# EAGLE design nRF51822 (EAGLE 6.4)
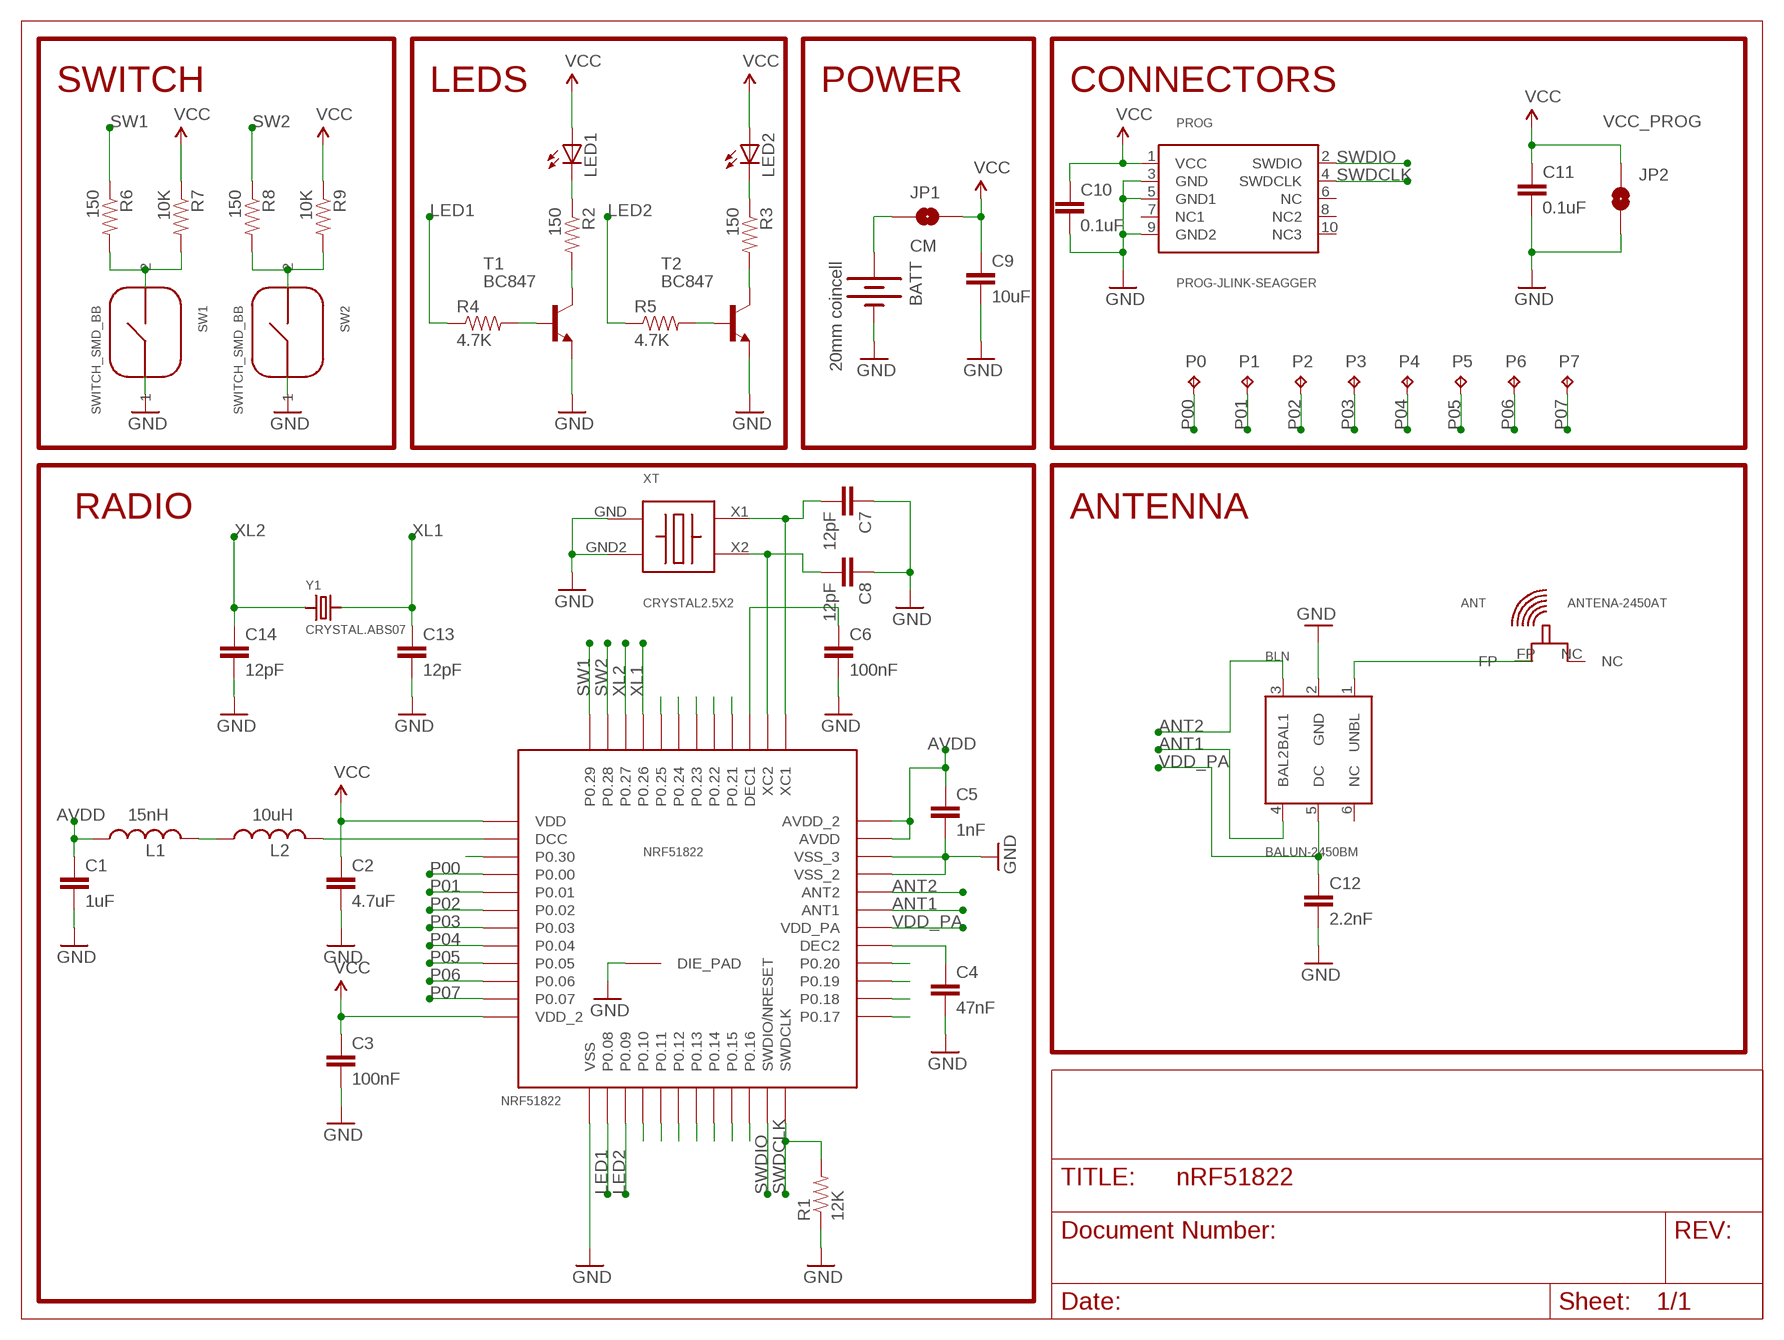
[diagram p0: schematic, sheet 1]

## Parts
ANT  ANTENA-2450AT  [2450AT18B100]
BATT  20mm coincell  BATTERY20MM_4LEGS_OVERPASTE  [BATTCON_20MM_4LEGS_OVERPASTE]
BLN  BALUN-2450BM  [2450BM14A0002]
C1  1uF  CAP0603-CAP  [0603-CAP]
C2  4.7uF  CAP0603-CAP  [0603-CAP]
C3  100nF  CAP0603-CAP  [0603-CAP]
C4  47nF  CAP0603-CAP  [0603-CAP]
C5  1nF  CAP0603-CAP  [0603-CAP]
C6  100nF  CAP0603-CAP  [0603-CAP]
C7  12pF  CAP0603-CAP  [0603-CAP]
C8  12pF  CAP0603-CAP  [0603-CAP]
C9  10uF  CAP0603-CAP  [0603-CAP]
C10  0.1uF  CAP0603-CAP  [0603-CAP]
C11  0.1uF  CAP0603-CAP  [0603-CAP]
C12  2.2nF  CAP0603-CAP  [0603-CAP]
C13  12pF  CAP0603-CAP  [0603-CAP]
C14  12pF  CAP0603-CAP  [0603-CAP]
JP1  CM  JUMP_SMDPITCH_0.05  [JUMP-0.05-SMD]
JP2  VCC_PROG  JUMP_SMDPITCH_0.05  [JUMP-0.05-SMD]
L1  15nH  INDUCTOR0603  [0603]
L2  10uH  INDUCTOR0603  [0603]
LED1  LED0603  [LED-0603]
LED2  LED0603  [LED-0603]
NRF51822  NRF51822  [QFN48]
P0  TPB1,27  [B1,27]
P1  TPB1,27  [B1,27]
P2  TPB1,27  [B1,27]
P3  TPB1,27  [B1,27]
P4  TPB1,27  [B1,27]
P5  TPB1,27  [B1,27]
P6  TPB1,27  [B1,27]
P7  TPB1,27  [B1,27]
PROG  PROG-JLINK-SEAGGER  [M50-3600742]
R1  12K  RESISTOR0603-RES  [0603-RES]
R2  150  RESISTOR0603-RES  [0603-RES]
R3  150  RESISTOR0603-RES  [0603-RES]
R4  4.7K  RESISTOR0603-RES  [0603-RES]
R5  4.7K  RESISTOR0603-RES  [0603-RES]
R6  150  RESISTOR0603-RES  [0603-RES]
R7  10K  RESISTOR0603-RES  [0603-RES]
R8  150  RESISTOR0603-RES  [0603-RES]
R9  10K  RESISTOR0603-RES  [0603-RES]
SW1  SWITCH_SMD_BB  [SWITCH3X2.5]
SW2  SWITCH_SMD_BB  [SWITCH3X2.5]
T1  BC847  [SOT23]
T2  BC847  [SOT23]
XT  CRYSTAL2.5X2  [2.5X2MM]
Y1  CRYSTAL.ABS07  [ABS07]

## Nets
ANT1 [DATA]: BLN.4(BAL2) NRF51822.31(ANT1)
ANT2 [DATA]: BLN.3(BAL1) NRF51822.32(ANT2)
AVDD [VCC]: C1.1 C5.1 L1.1 NRF51822.35(AVDD) NRF51822.36(AVDD_2)
GND [GND]: BATT.2(-) BLN.2(GND) C1.2 C2.2 C3.2 C4.2 C5.2 C6.2 C7.1 C8.1 C9.2 C10.2 C11.2 C12.2 C13.2 C14.2 JP2.P$2 NRF51822.13(VSS) NRF51822.33(VSS_2) NRF51822.34(VSS_3) NRF51822.GND(DIE_PAD) PROG.3(GND) PROG.5(GND1) PROG.9(GND2) R1.1 SW1.1 SW2.1 T1.2(E) T2.2(E) XT.GND XT.GND2
LED1 [DATA]: NRF51822.14(P0.08) R4.1
LED2 [DATA]: NRF51822.15(P0.09) R5.1
N$1 [VCC]: C6.1 NRF51822.39(DEC1)
N$2 [VCC]: L1.2 L2.1
N$3 [VCC]: L2.2 NRF51822.2(DCC)
N$4 [DATA]: C8.2 NRF51822.38(XC2) XT.X2
N$5 [DATA]: C7.2 NRF51822.37(XC1) XT.X1
N$6 [VCC]: C4.1 NRF51822.29(DEC2)
N$7 [DATA]: R5.2 T2.1(B)
N$8: NRF51822.22(P0.16)
N$10: NRF51822.16(P0.10)
N$11: NRF51822.17(P0.11)
N$12: NRF51822.18(P0.12)
N$13: NRF51822.19(P0.13)
N$14: NRF51822.20(P0.14)
N$15: NRF51822.21(P0.15)
N$16 [VCC]: BATT.1(+) JP1.P$1
N$17 [VCC]: R3.2 T2.3(C)
N$18 [VCC]: LED2.C R3.1
N$19 [VCC]: R8.2 R9.2 SW2.2
N$21 [VCC]: R2.2 T1.3(C)
N$22 [DATA]: ANT.FP BLN.1(UNBL)
N$24: NRF51822.44(P0.25)
N$25: NRF51822.43(P0.24)
N$26: NRF51822.42(P0.23)
N$27 [VCC]: LED1.C R2.1
N$28: NRF51822.25(P0.17)
N$29: NRF51822.26(P0.18)
N$30: NRF51822.27(P0.19)
N$31: NRF51822.28(P0.20)
N$32: NRF51822.41(P0.22)
N$33: NRF51822.40(P0.21)
N$34 [DATA]: R4.2 T1.1(B)
N$35 [VCC]: R6.2 R7.2 SW1.2
N$38: NRF51822.3(P0.30)
P00 [DATA]: NRF51822.4(P0.00) P0.TP
P01 [DATA]: NRF51822.5(P0.01) P1.TP
P02 [DATA]: NRF51822.6(P0.02) P2.TP
P03 [DATA]: NRF51822.7(P0.03) P3.TP
P04 [DATA]: NRF51822.8(P0.04) P4.TP
P05 [DATA]: NRF51822.9(P0.05) P5.TP
P06 [DATA]: NRF51822.10(P0.06) P6.TP
P07 [DATA]: NRF51822.11(P0.07) P7.TP
SW1 [DATA]: NRF51822.48(P0.29) R6.1
SW2 [DATA]: NRF51822.47(P0.28) R8.1
SWDCLK [DATA]: NRF51822.24(SWDCLK) PROG.4(SWDCLK) R1.2
SWDIO [DATA]: NRF51822.23(SWDIO/NRESET) PROG.2(SWDIO)
VCC [VCC]: C2.1 C3.1 C9.1 C10.1 C11.1 JP1.P$2 JP2.P$1 LED1.A LED2.A NRF51822.1(VDD) NRF51822.12(VDD_2) PROG.1(VCC) R7.1 R9.1
VDD_PA [VCC]: BLN.5(DC) C12.1 NRF51822.30(VDD_PA)
XL1 [DATA]: C13.1 NRF51822.45(P0.26) Y1.2
XL2 [DATA]: C14.1 NRF51822.46(P0.27) Y1.1
Unconnected: ANT.NC BLN.6(NC) PROG.6(NC) PROG.7(NC1) PROG.8(NC2) PROG.10(NC3)

## Notes on the sheet
- SWITCH | LEDS | POWER | CONNECTORS
- RADIO | ANTENNA

## Library data of the parts
ANT = NordicSemi:ANTENA-2450AT: General Specifications: Part Number 2450AT18B100 Input Power 3W max. Frequency Range 2400 - 2500 Mhz Impedance 50 Ω Peak Gain 0.5 dBi typ. (XZ-V) Operating Temperature -40 to +85°C Average Gain -0.5 dBi typ. (XZ-V) Reel Quanity 3,000 Return Loss 9.5 dB min
BATT = SparkFun-Electromechanical:BATTERY: Battery Holders Various common sizes : AA, AAA, 20mm coin cell and 12mm coin cell. 20MM_4LEGS, BATT-10373
BLN = NordicSemi:BALUN-2450BM: General Specifications: Part Number 2450BM14A0002 Insertion Loss 2.0 dB max. Frequency (MHz) 2400 - 2500 Return Loss 9.5 dB min. Unbalanced Impedance 50 Ω Phase Difference 160° ± 15° Amplitude Difference 3.5 ± 1.5 dB Reel Quanity 4,000 Operating Temperature -40 to +85°C Attenuation: Common Mode 2.45 GHz Impedance Matched Balun-Filter: Optimized for Nordic's Chipset nRF24L01/+ Differential Balanced Impedance Conjugate match to Nordic nRF24L01/nRF24L01+ Attenuation: Differential Mode 15 min.@4800~5000MHz 15 min.@7200~7500MHz
C1-C14 = SparkFun-Capacitors:CAP: Capacitor Standard 0603 ceramic capacitor, and 0.1" leaded capacitor.
JP1 JP2 = NordicSemi:JUMP_SMD
L1 L2 = SparkFun-Passives:INDUCTOR: Inductors Basic Inductor/Choke - 0603 and 1206. Footprints are not proven and vary greatly between part numbers. SRN6045- 33uH, 20% 1.4A
LED1 LED2 = SparkFun-LED:LED: LEDs Standard schematic elements and footprints for 5mm, 3mm, 1206, and 0603 sized LEDs. 5mm - Spark Fun Electronics SKU : COM-00529 (and others)
NRF51822 = NordicSemi:NRF51822: Bluetooth 4.0 Low Energy/2.4Ghz NORDIC SEMICONDUCTOR
P0 P1-P7 = testpad:TP: Test pad
PROG = NordicSemi:PROG-JLINK-SEAGGER: 1.27mm Pitch Dil Vertical SMT Pin Header Manufacturer: Harwin Product Number: M50-3601042
R1-R9 = SparkFun-Resistors:RESISTOR: Resistor Basic schematic elements and footprints for 0603, 1206, and PTH resistors.
SW1 SW2 = NordicSemi:SWITCH_SMD_BB
T1 T2 = transistor:BC847: NPN TRANSISTOR
XT = NordicSemi:CRYSTAL2.5X2: Crystal 16.00MHz 8pF SMD Size Dimension: 2.5mm x 2.00mm Package: 4-SMD
Y1 = abracon:CRYSTAL

## Net classes
1 DATA: width 0.152 mm, drill 0.381 mm
2 VCC: width 0.406 mm, drill 0.381 mm
3 GND: width 0.406 mm, drill 0.381 mm

## Board
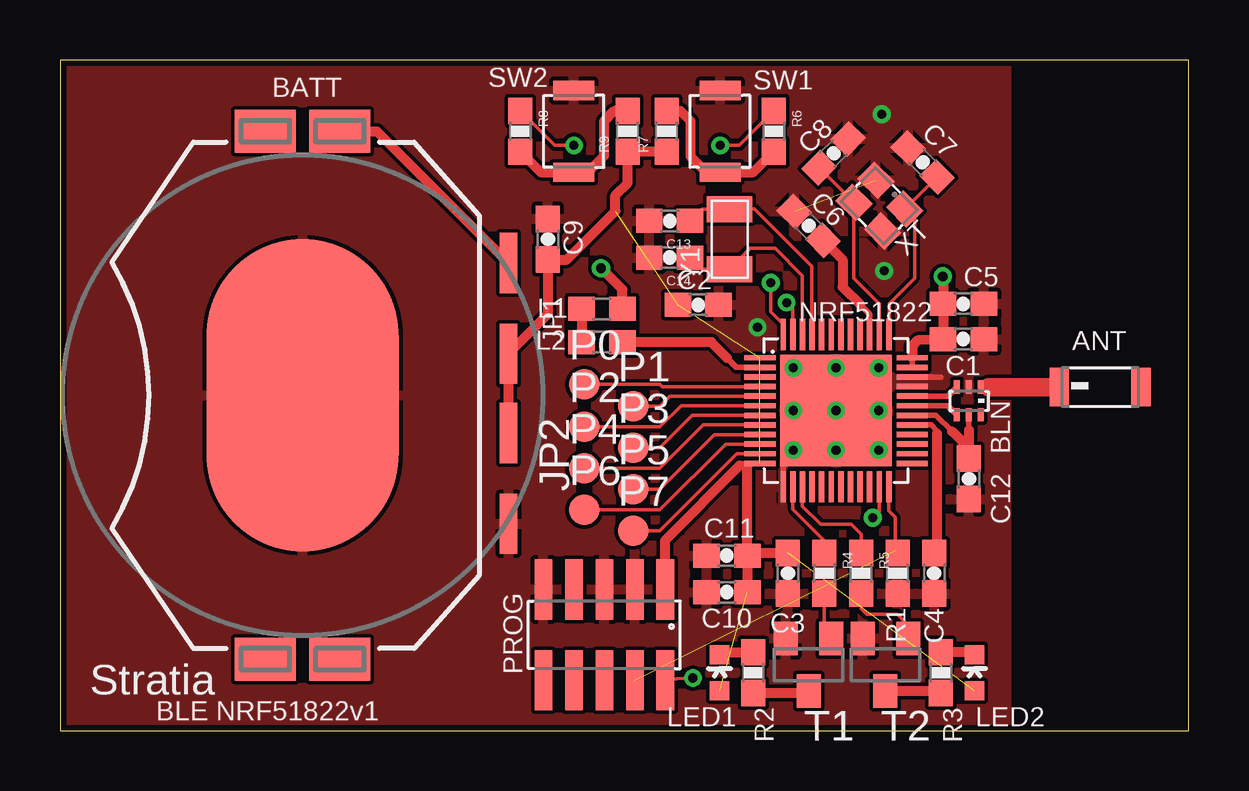
[diagram p1: board, top side]
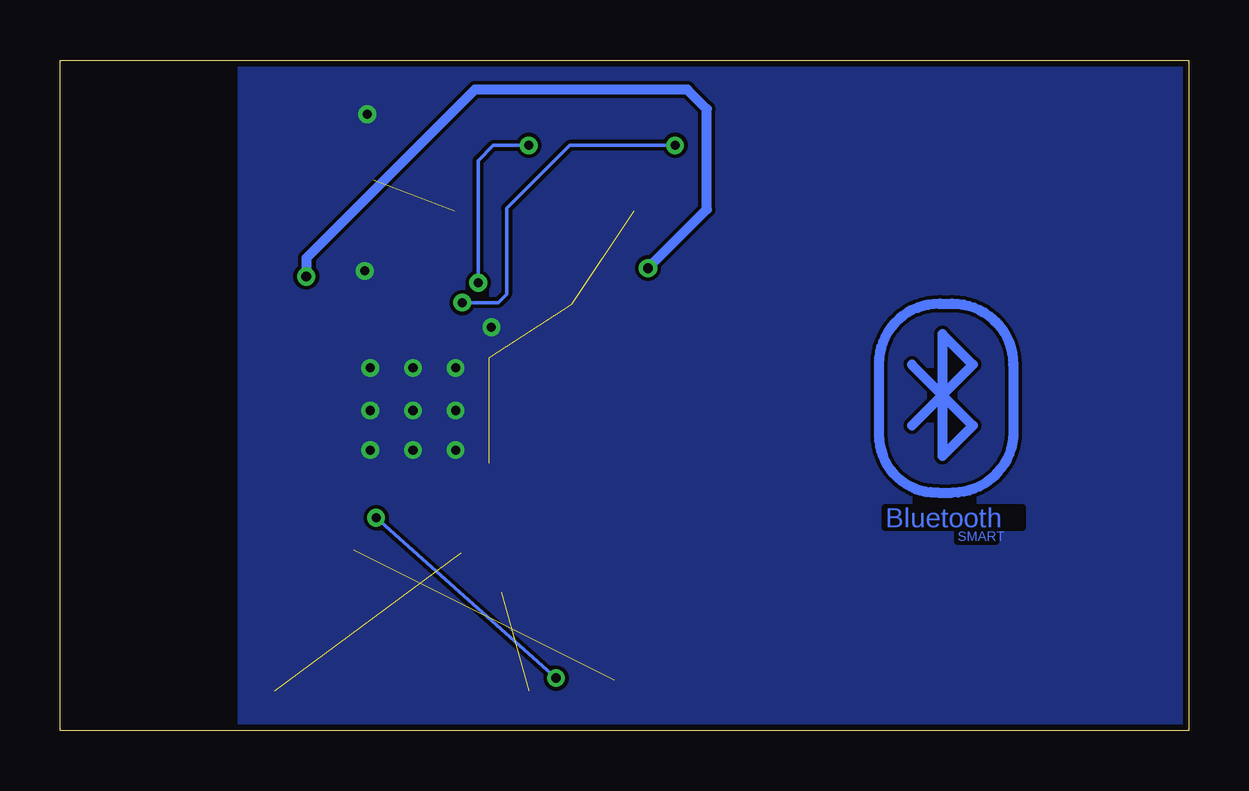
[diagram p2: board, bottom side, seen from below]

Size 47.04 x 27.94 mm. Coordinates in mm from the lower left corner, seen from the top.
Outline: 0,0 47.04,0 47.04,27.94 0,27.94 0,0
Copper layers (1*16): Top 0.035mm / dielectric 1.5mm / Bottom 0.035mm
Design rules "default": minimum track width 6mil, minimum drill 15mil, track to track 6mil, track to pad 6mil, pad to pad 6mil, via to via 6mil, smd to smd 6mil, copper to edge 10mil, drill to drill 7mil, minimum pad ring 7mil, minimum via ring 7mil, stop-mask expansion 2mil, vias tented up to drill 15mil, thermal gap 7mil
tRestrict: area 39.8,0 to 47,27.9
bRestrict: area 39.8,0 to 47,27.9

### Footprints (pad centres in the part's own frame; a part is rotated, then mirrored left to right if it is on the bottom)
2450AT18B100 = smd 0.8 x 1.6: FP -1.7,0; NC 1.7,0
BATTCON_20MM_4LEGS_OVERPASTE = smd 1.778 x 2.54: 1 -11,1.55; 3 11,1.55; P$1 -11,-1.55; P$2 11,-1.55 | smd 13 x 8: 2 0,0
2450BM14A0002 = smd 0.25 x 0.55: 1 0.5,0.575; 2 0,0.575; 3 -0.5,0.575; 4 -0.5,-0.575; 5 0,-0.575; 6 0.5,-0.575
0603-CAP = smd 1.1 x 1: 1 -0.85,0; 2 0.85,0
JUMP-0.05-SMD = smd 2.515 x 0.74: P$1 -1.893,0; P$2 1.893,0
0603 = smd 1.1 x 1: 1 -0.85,0; 2 0.85,0
LED-0603 = smd 0.8 x 0.8: A 0,-0.75; C 0,0.75
QFN48 = smd 1.3 x 0.226: 1 -3.17,2.2; 2 -3.17,1.8; 3 -3.17,1.4; 4 -3.17,1; 5 -3.17,0.6; 6 -3.17,0.2; 7 -3.17,-0.2; 8 -3.17,-0.6; 9 -3.17,-1; 10 -3.17,-1.4; 11 -3.17,-1.8; 12 -3.17,-2.2; 25 3.17,-2.2; 26 3.17,-1.8; 27 3.17,-1.4; 28 3.17,-1; 29 3.17,-0.6; 30 3.17,-0.2; 31 3.17,0.2; 32 3.17,0.6; 33 3.17,1; 34 3.17,1.4; 35 3.17,1.8; 36 3.17,2.2 | smd 0.226 x 1.3: 13 -2.2,-3.17; 14 -1.8,-3.17; 15 -1.4,-3.17; 16 -1,-3.17; 17 -0.6,-3.17; 18 -0.2,-3.17; 19 0.2,-3.17; 20 0.6,-3.17; 21 1,-3.17; 22 1.4,-3.17; 23 1.8,-3.17; 24 2.2,-3.17; 37 2.2,3.17; 38 1.8,3.17; 39 1.4,3.17; 40 1,3.17; 41 0.6,3.17; 42 0.2,3.17; 43 -0.2,3.17; 44 -0.6,3.17; 45 -1,3.17; 46 -1.4,3.17; 47 -1.8,3.17; 48 -2.2,3.17 | smd 4.66 x 4.66: GND 0,0
B1,27 = smd 1.27 x 1.27: TP 0,0
M50-3600742 = smd 0.74 x 2.515: 1 -2.54,-1.893; 2 -2.54,1.893; 3 -1.27,-1.893; 4 -1.27,1.893; 5 0,-1.893; 6 0,1.893; 7 1.27,-1.893; 8 1.27,1.893; 9 2.54,-1.893; 10 2.54,1.893
0603-RES = smd 1.1 x 1: 1 -0.85,0; 2 0.85,0
SWITCH3X2.5 = smd 0.8 x 1.7: 1 1.7,0; 2 -1.7,0
SOT23 = smd 1 x 1.4: 1 -0.95,-1.1; 2 0.95,-1.1; 3 0,1.1
2.5X2MM = smd 1.2 x 1: GND 0.85,-0.65; GND2 -0.85,0.65; X1 -0.85,-0.65; X2 0.85,0.65
ABS07 = smd 1.1 x 1.9: 1 -1.25,0; 2 1.25,0

### Placement (x,y rotation side)
ANT  43.34,14.31 0 top
BATT  10.11,13.97 270 top
BLN  37.87,13.74 0 top
C1  37.64,16.31 0 top
C2  26.59,17.74 0 top
C3  30.33,6.55 270 top
C4  36.42,6.55 270 top
C5  37.64,17.78 0 top
C6  31.19,21.03 135 top
C7  35.94,23.67 315 top
C8  32.23,24.05 225 top
C9  20.33,20.47 90 top
C10  27.79,5.77 180 top
C11  27.79,7.29 180 top
C12  37.87,10.49 270 top
C13  25.4,21.23 180 top
C14  25.4,19.71 180 top
JP1  18.69,17.6 270 top
JP2  18.69,10.51 270 top
L1  22.58,17.58 180 top
L2  22.58,16.18 0 top
LED1  27.48,2.41 0 top
LED2  38.1,2.41 0 top
NRF51822  32.33,13.34 0 top
P0  21.84,14.43 0 top
P1  23.88,13.51 0 top
P2  21.84,12.65 0 top
P3  23.88,11.79 0 top
P4  21.84,10.92 0 top
P5  23.88,10.06 0 top
P6  21.84,9.19 0 top
P7  23.88,8.33 0 top
PROG  22.68,3.99 180 top
R1  34.9,6.55 90 top
R2  28.88,2.41 270 top
R3  36.7,2.41 270 top
R4  31.85,6.55 270 top
R5  33.38,6.55 270 top
R6  29.74,24.97 270 top
R7  25.27,24.97 90 top
R8  19.18,24.97 270 top
R9  23.65,24.97 90 top
SW1  27.51,24.97 90 top
SW2  21.41,24.97 90 top
T1  31.19,2.74 180 top
T2  34.39,2.74 180 top
XT  34.14,21.87 135 top
Y1  27.9,20.47 90 top

### Tracks (layer width: path | path; a pad name or v marks a point on that pad's centre or on a via)
ANT1
  Top 0.229: NRF51822.31 37,13.54 BLN.4
ANT2
  Top 0.229: NRF51822.32 36.99,13.94 BLN.3
AVDD  (via drill 0.41)
  Top 0.229: NRF51822.35 NRF51822.36
  Top 0.406: 23.48,17.63 L1.1 23.43,18.38 v22.54,19.27 | v36.78,18.92 36.79,18.91 C5.1 C1.1 35.74,16.26 35.5,16.02 NRF51822.36
  Bottom 0.406: 36.78,19.07 v36.78,18.92 36.78,19.68 29.76,26.71 20.9,26.71 20.09,25.89 20.09,21.72 v22.54,19.27
GND  (via drill 0.38)  (1 unrouted)
  Top 0.229: NRF51822.13 30.13,11.26 v30.56,11.68 | NRF51822.34 35.36,14.73 | 35.36,14.73 36.3,14.73 | 35.36,14.73 36.7,14.73
  other vias: 34.11,11.68 34.11,15.11 30.56,13.34 32.33,13.34 34.11,13.34 32.33,15.11 32.33,11.68 29.07,16.8 34.34,19.15 34.24,25.68 30.56,15.11
  pour Top: 0,0 47.04,0 47.04,27.94 0,27.94
  pour Bottom: 0,0 47.04,0 47.04,27.94 0,27.94
LED1
  Top 0.152: NRF51822.14 30.53,9.23 31.85,7.91 R4.1
LED2
  Top 0.152: NRF51822.15 30.93,9.35 31.69,8.59 32.96,8.59 33.38,8.18 R5.1
N$1
  Top 0.229: 33.74,17.03 33.73,17.02 | 33.73,17.02 NRF51822.39 | 33.34,17.75 33.73,17.36 33.73,17.02
  Top 0.406: C6.1 32.61,19.61 32.61,18.48 33.34,17.75
N$2
  Top 0.406: L1.2 L2.1
N$3
  Top 0.229: NRF51822.2 28.18,15.13 27.8,15.52
  Top 0.406: L2.2 27.14,16.18 27.8,15.52
N$4
  Top 0.152: C8.2 XT.X2 | NRF51822.38 34.13,17.78 33.08,18.84 XT.X2 | 33.1,21.99 XT.X2
N$5
  Top 0.152: C7.2 XT.X1 35.61,21.32 35.61,18.85 34.54,17.78 34.54,16.36 NRF51822.37
N$6
  Top 0.229: NRF51822.29 36.3,12.73 36.54,12.5 36.54,12.38
  Top 0.406: 36.54,12.38 36.54,7.52 C4.1
N$7
  Top 0.152: T2.1 35.34,4.4 34.89,4.85 33.6,4.85 33.38,5.08 R5.2
N$9
  Bottom 0.406: 10.27,13.98 10.27,16.52 9,15.25 10.27,13.98 | 10.27,13.98 10.27,11.44 9,12.71 10.27,13.98 | 10.27,13.98 11.54,15.25 | 10.27,13.98 11.54,12.71
N$16
  Top 0.406: BATT.1 13.2,24.97 JP1.P$1
N$17
  Top 0.406: R3.2 36.62,1.64 T2.3
N$18
  Top 0.406: LED2.C 38,3.26 R3.1
N$19
  Top 0.406: R8.2 20.03,23.27 SW2.2 21.98,23.27 22.66,23.94 22.66,25.38 23.1,25.82 R9.2
N$20
  Bottom 0.406: 10.37,17.79 9.87,17.79 arc90 7.33,15.25 7.32,15.25 7.32,12.45 arc90 9.86,9.91 10.46,9.91
N$21
  Top 0.406: T1.3 31.11,1.56 R2.2
N$22
  Top 0.254: BLN.1 38.42,14.31
  Top 0.305: 38.42,14.31 38.54,14.31
  Top 0.406: 38.54,14.31 38.7,14.31
  Top 0.762: 38.7,14.31 ANT.FP
N$23
  Bottom 0.406: 10.38,17.78 10.42,17.78 arc-90 12.92,15.3 12.92,12.3 arc-90 10.54,9.92
N$27
  Top 0.406: LED1.C 27.58,3.26 R2.1
N$34
  Top 0.152: T1.1 31.85,4.13 R4.2
N$35
  Top 0.406: R6.2 28.89,23.27 SW1.2 26.94,23.27 26.26,23.94 26.26,25.4 25.84,25.82 R7.2
P00
  Top 0.152: 21.86,14.44 P0.TP 24.99,14.43 25.09,14.34 NRF51822.4
P01
  Top 0.152: P1.TP 24.99,13.51 25.42,13.94 NRF51822.5
P02
  Top 0.152: P2.TP 24.99,12.65 25.88,13.54 NRF51822.6
P03
  Top 0.152: P3.TP 24.99,11.79 26.34,13.13 NRF51822.7
P04
  Top 0.152: P4.TP 24.99,10.92 26.81,12.73 NRF51822.8
P05
  Top 0.152: NRF51822.9 27.27,12.34 24.99,10.06 P5.TP
P06
  Top 0.152: P6.TP 24.99,9.2 27.73,11.94 NRF51822.10
P07
  Top 0.152: P7.TP 24.99,8.33 28.2,11.54 NRF51822.11
SW1  (via drill 0.38)
  Top 0.152: NRF51822.48 30.13,16.93 29.62,17.45 v29.62,18.66 | R6.1 28.31,24.38 v27.51,24.38
  Bottom 0.152: v29.62,18.66 29.62,23.75 28.98,24.38 v27.51,24.38
SW2  (via drill 0.38)
  Top 0.152: NRF51822.47 30.53,17.57 v30.28,17.83 | R8.1 20.61,24.38 v21.41,24.38
  Bottom 0.152: v30.28,17.83 28.78,17.83 28.43,18.19 28.43,21.76 25.81,24.38 v21.41,24.38
SWDCLK  (1 unrouted)
  Top 0.152: R1.2 34.8,7.5 34.8,8.89 34.53,9.15 NRF51822.24
SWDIO  (via drill 0.38)
  Top 0.152: PROG.2 25.69,2.16 v26.37,2.19 | NRF51822.23 34.13,9.13 v33.87,8.87
  Bottom 0.152: v33.87,8.87 v26.37,2.19
VCC  (5 unrouted)
  Top 0.203: 28.64,11.13 NRF51822.12 28.41,11.13 28.32,11.05
  Top 0.229: 28.64,11.04 28.64,11.13
  Top 0.406: JP2.P$1 JP1.P$2 20.33,17.35 C9.1 21.12,19.62 23.14,21.64 23.14,22.3 23.65,22.81 R9.1 R7.1 | 28.75,7.4 C11.1 C10.1 | 28.75,7.4 C3.1 | 28.75,7.4 arc-90 28.64,7.52 28.64,11.04 | PROG.1 25.22,7.94 28.32,11.05
VDD_PA
  Top 0.229: NRF51822.30 36.5,13.13 37.17,12.46 | BLN.5 37.87,12.52
  Top 0.406: 37.17,12.46 37.87,11.76 | 37.87,12.52 37.87,11.76 | 37.87,11.76 C12.1
XL1
  Top 0.152: 27.9,21.73 Y1.2 | Y1.2 28.93,21.74 31.33,19.34 NRF51822.45 | C13.1 26.74,21.72 Y1.2
XL2
  Top 0.152: 27.9,19.24 Y1.1 | Y1.1 28.75,20.09 29.8,20.09 30.93,18.96 NRF51822.46 | C14.1 26.74,19.22 Y1.1

### Text on the board
Bottom: SMART | Bluetooth
tNames: Stratia | BLE NRF51822v1